# Altium schematic sheet VNA2.SchDoc
size A4
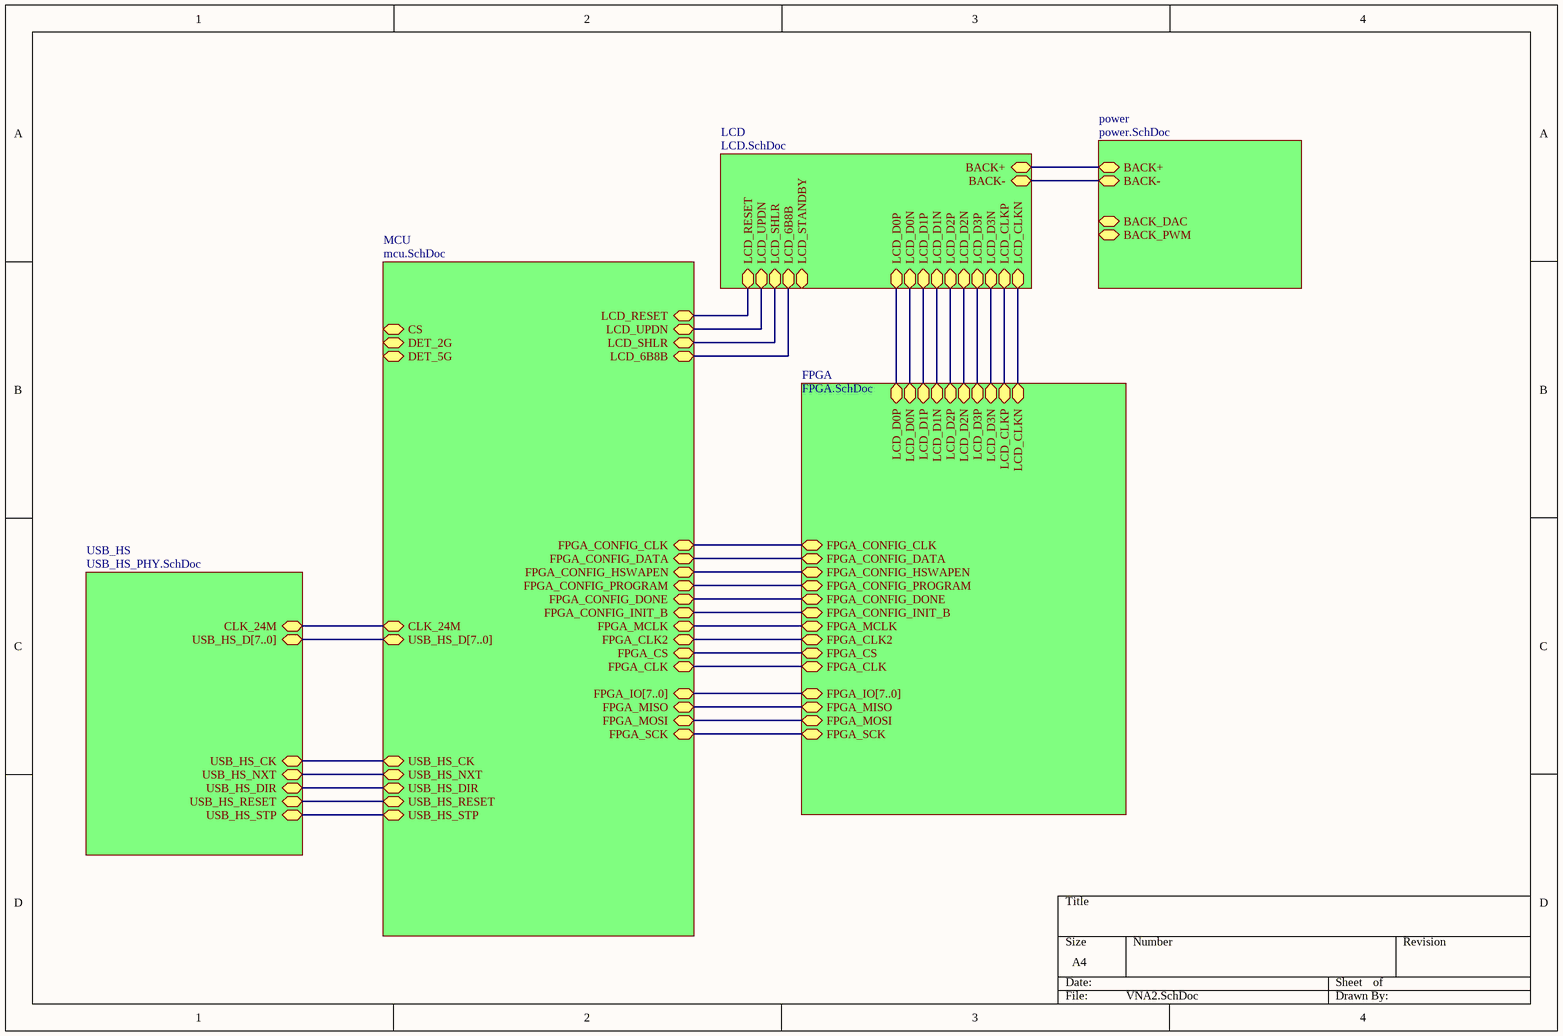
[diagram p0: VNA2.SchDoc]

## Sub-sheets
FPGA = FPGA.SchDoc: FPGA_CLK, FPGA_CS, FPGA_MISO, FPGA_MOSI, FPGA_SCK, FPGA_CLK2, FPGA_MCLK, FPGA_IO[7..0], FPGA_CONFIG_DONE, FPGA_CONFIG_DATA, FPGA_CONFIG_CLK, FPGA_CONFIG_PROGRAM, FPGA_CONFIG_HSWAPEN, FPGA_CONFIG_INIT_B, LCD_CLKP, LCD_CLKN, LCD_D1N, LCD_D2N, LCD_D3N, LCD_D3P, LCD_D2P, LCD_D1P, LCD_D0P, LCD_D0N
LCD = LCD.SchDoc: LCD_RESET, BACK-, BACK+, LCD_6B8B, LCD_STANDBY, LCD_D0N, LCD_D1P, LCD_D0P, LCD_D2P, LCD_D3P, LCD_D1N, LCD_CLKN, LCD_CLKP, LCD_D3N, LCD_D2N, LCD_SHLR, LCD_UPDN
MCU = mcu.SchDoc: USB_HS_STP, USB_HS_CK, USB_HS_RESET, DET_2G, DET_5G, CS, FPGA_CONFIG_CLK, FPGA_CONFIG_DATA, FPGA_CONFIG_HSWAPEN, FPGA_CONFIG_PROGRAM, FPGA_CONFIG_DONE, FPGA_CONFIG_INIT_B, FPGA_CLK, FPGA_IO[7..0], FPGA_MCLK, USB_HS_DIR, USB_HS_NXT, LCD_SHLR, LCD_6B8B, FPGA_MISO, FPGA_MOSI, FPGA_SCK, CLK_24M, FPGA_CLK2, FPGA_CS, LCD_RESET, LCD_UPDN, USB_HS_D[7..0]
power = power.SchDoc: BACK+, BACK_PWM, BACK_DAC, BACK-
USB_HS = USB_HS_PHY.SchDoc: CLK_24M, USB_HS_CK, USB_HS_NXT, USB_HS_DIR, USB_HS_RESET, USB_HS_STP, USB_HS_D[7..0]

## Nets
(unnamed): sheet FPGA/FPGA_CLK, sheet MCU/FPGA_CLK
(unnamed): sheet FPGA/FPGA_CS, sheet MCU/FPGA_CS
(unnamed): sheet FPGA/FPGA_MISO, sheet MCU/FPGA_MISO
(unnamed): sheet FPGA/FPGA_MOSI, sheet MCU/FPGA_MOSI
(unnamed): sheet FPGA/FPGA_SCK, sheet MCU/FPGA_SCK
(unnamed): sheet FPGA/FPGA_CLK2, sheet MCU/FPGA_CLK2
(unnamed): sheet FPGA/FPGA_MCLK, sheet MCU/FPGA_MCLK
(unnamed): sheet FPGA/FPGA_CONFIG_DONE, sheet MCU/FPGA_CONFIG_DONE
(unnamed): sheet FPGA/FPGA_CONFIG_DATA, sheet MCU/FPGA_CONFIG_DATA
(unnamed): sheet FPGA/FPGA_CONFIG_CLK, sheet MCU/FPGA_CONFIG_CLK
(unnamed): sheet FPGA/FPGA_CONFIG_PROGRAM, sheet MCU/FPGA_CONFIG_PROGRAM
(unnamed): sheet FPGA/FPGA_CONFIG_HSWAPEN, sheet MCU/FPGA_CONFIG_HSWAPEN
(unnamed): sheet FPGA/FPGA_CONFIG_INIT_B, sheet MCU/FPGA_CONFIG_INIT_B
(unnamed): sheet FPGA/LCD_CLKP, sheet LCD/LCD_CLKP
(unnamed): sheet FPGA/LCD_CLKN, sheet LCD/LCD_CLKN
(unnamed): sheet FPGA/LCD_D1N, sheet LCD/LCD_D1N
(unnamed): sheet FPGA/LCD_D2N, sheet LCD/LCD_D2N
(unnamed): sheet FPGA/LCD_D3N, sheet LCD/LCD_D3N
(unnamed): sheet FPGA/LCD_D3P, sheet LCD/LCD_D3P
(unnamed): sheet FPGA/LCD_D2P, sheet LCD/LCD_D2P
(unnamed): sheet FPGA/LCD_D1P, sheet LCD/LCD_D1P
(unnamed): sheet FPGA/LCD_D0P, sheet LCD/LCD_D0P
(unnamed): sheet FPGA/LCD_D0N, sheet LCD/LCD_D0N
(unnamed): sheet MCU/USB_HS_STP, sheet USB_HS/USB_HS_STP
(unnamed): sheet MCU/USB_HS_CK, sheet USB_HS/USB_HS_CK
(unnamed): sheet MCU/USB_HS_RESET, sheet USB_HS/USB_HS_RESET
(unnamed): sheet MCU/USB_HS_DIR, sheet USB_HS/USB_HS_DIR
(unnamed): sheet MCU/USB_HS_NXT, sheet USB_HS/USB_HS_NXT
(unnamed): sheet MCU/LCD_SHLR, sheet LCD/LCD_SHLR
(unnamed): sheet MCU/LCD_6B8B, sheet LCD/LCD_6B8B
(unnamed): sheet MCU/CLK_24M, sheet USB_HS/CLK_24M
(unnamed): sheet MCU/LCD_RESET, sheet LCD/LCD_RESET
(unnamed): sheet MCU/LCD_UPDN, sheet LCD/LCD_UPDN
(unnamed): sheet LCD/BACK-, sheet power/BACK-
(unnamed): sheet LCD/BACK+, sheet power/BACK+

## Buses and harness runs
bus sheet FPGA/FPGA_IO[7..0] = sheet MCU/FPGA_IO[7..0]
bus sheet MCU/USB_HS_D[7..0] = sheet USB_HS/USB_HS_D[7..0]